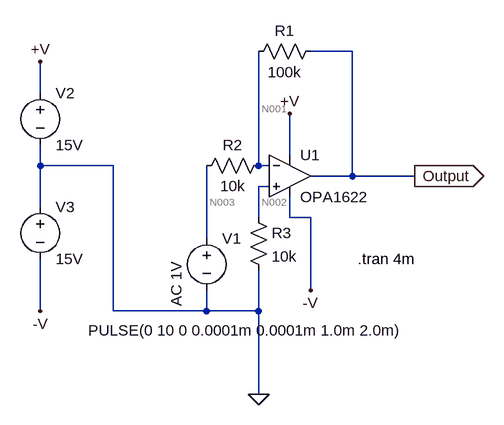
[diagram p0: schematic 25.1_10.(1)_transcient.asc]
25.1_10.(1)_transcient.asc, the LTspice schematic file:
Version 4
SHEET 1 880 680
WIRE 320 0 256 0
WIRE -160 64 -160 16
WIRE 224 160 224 96
WIRE -160 176 -160 144
WIRE -48 176 -160 176
WIRE 176 176 176 0
WIRE 192 176 176 176
WIRE 320 192 320 0
WIRE 320 192 256 192
WIRE 416 192 320 192
WIRE 192 208 176 208
WIRE -160 240 -160 176
WIRE 176 256 176 208
WIRE 224 256 224 224
WIRE 256 256 224 256
WIRE 96 288 96 176
WIRE 256 368 256 256
WIRE -160 400 -160 320
WIRE -48 400 -48 176
WIRE 96 400 96 368
WIRE 96 400 -48 400
WIRE 176 400 176 336
WIRE 176 400 96 400
WIRE 176 528 176 400
FLAG 416 192 Output
IOPIN 416 192 Out
FLAG 176 528 0
FLAG -160 16 +V
FLAG 224 96 +V
FLAG -160 400 -V
FLAG 256 368 -V
SYMBOL voltage -160 48 R0
WINDOW 123 0 0 Left 2
WINDOW 39 0 0 Left 2
SYMATTR InstName V2
SYMATTR Value 15V
SYMBOL voltage -160 224 R0
WINDOW 123 0 0 Left 2
WINDOW 39 0 0 Left 2
SYMATTR InstName V3
SYMATTR Value 15V
SYMBOL voltage 96 272 R0
WINDOW 123 -47 121 VLeft 2
WINDOW 39 0 0 Left 2
WINDOW 3 -182 158 Left 2
SYMATTR Value2 AC 1V
SYMATTR Value PULSE(0 10 0 0.0001m 0.0001m 1.0m 2.0m)
SYMATTR InstName V1
SYMBOL res 192 160 R90
WINDOW 0 0 56 VBottom 2
WINDOW 3 32 56 VTop 2
SYMATTR InstName R2
SYMATTR Value 10k
SYMBOL res 160 240 R0
SYMATTR InstName R3
SYMATTR Value 10k
SYMBOL res 272 -16 R90
WINDOW 0 0 56 VBottom 2
WINDOW 3 32 56 VTop 2
SYMATTR InstName R1
SYMATTR Value 100k
SYMBOL Opamps\\OPA1622 224 128 R0
SYMATTR InstName U1
TEXT 328 320 Left 2 !.tran 4m

The netlist it stands for:
* 25.1_10.(1)_transcient.asc
V2 +V 0 15V
V3 0 -V 15V
V1 N003 0 PULSE(0 10 0 0.0001m 0.0001m 1.0m 2.0m) AC 1V
R2 N001 N003 10k
R3 N002 0 10k
R1 Output N001 100k
XU1 N002 N001 +V -V Output OPA1622  ; pins In+ In- V+ V- OUT
.tran 4m
.backanno
.end

* Results of the author's LTspice run, read from the files saved beside the schematic
* Operating Point, zero values left out:
*   V(+v) = 15 V
*   V(-v) = -15 V
*   V(n001) = -11.9 mV
*   V(n002) = -12 mV
*   V(output) = -11.9 mV
*   I(R1) = 41.55 pA
*   I(R3) = -1.2 µA
*   I(R2) = -1.19 µA
*   I(V1) = -1.19 µA
*   I(V3) = -2.6 mA
*   I(V2) = -2.6 mA
*   Ix(u1:IN+) = 1.2 µA
*   Ix(u1:IN-) = 1.19 µA
*   Ix(u1:VCC) = 2.6 mA
*   Ix(u1:VEE) = -2.6 mA
*   Ix(u1:OUT) = -41.55 pA
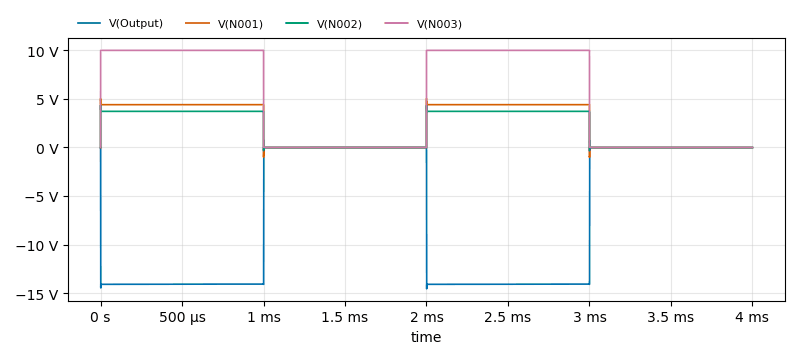
[diagram p1: Transient Analysis of 25.1_10.(1)_transcient.asc, plotted from the saved traces]
* Transient Analysis, 1 run:
*   V(Output): min -14.56 V, max 713 mV, average -7.053 V, rms 9.963 V, last -11.9 mV
*   V(N001): min -1.009 V, max 5.023 V, average 2.197 V, rms 3.116 V, last -11.9 mV
*   V(N002): min -332.2 mV, max 4.335 V, average 1.853 V, rms 2.629 V, last -12 mV
*   V(N003): min 0 V, max 10 V, average 5 V, rms 7.071 V, last 0 V